# Altium schematic sheet 4_esp32.SchDoc
size A4; SheetNumber: 5; SheetTotal: 13
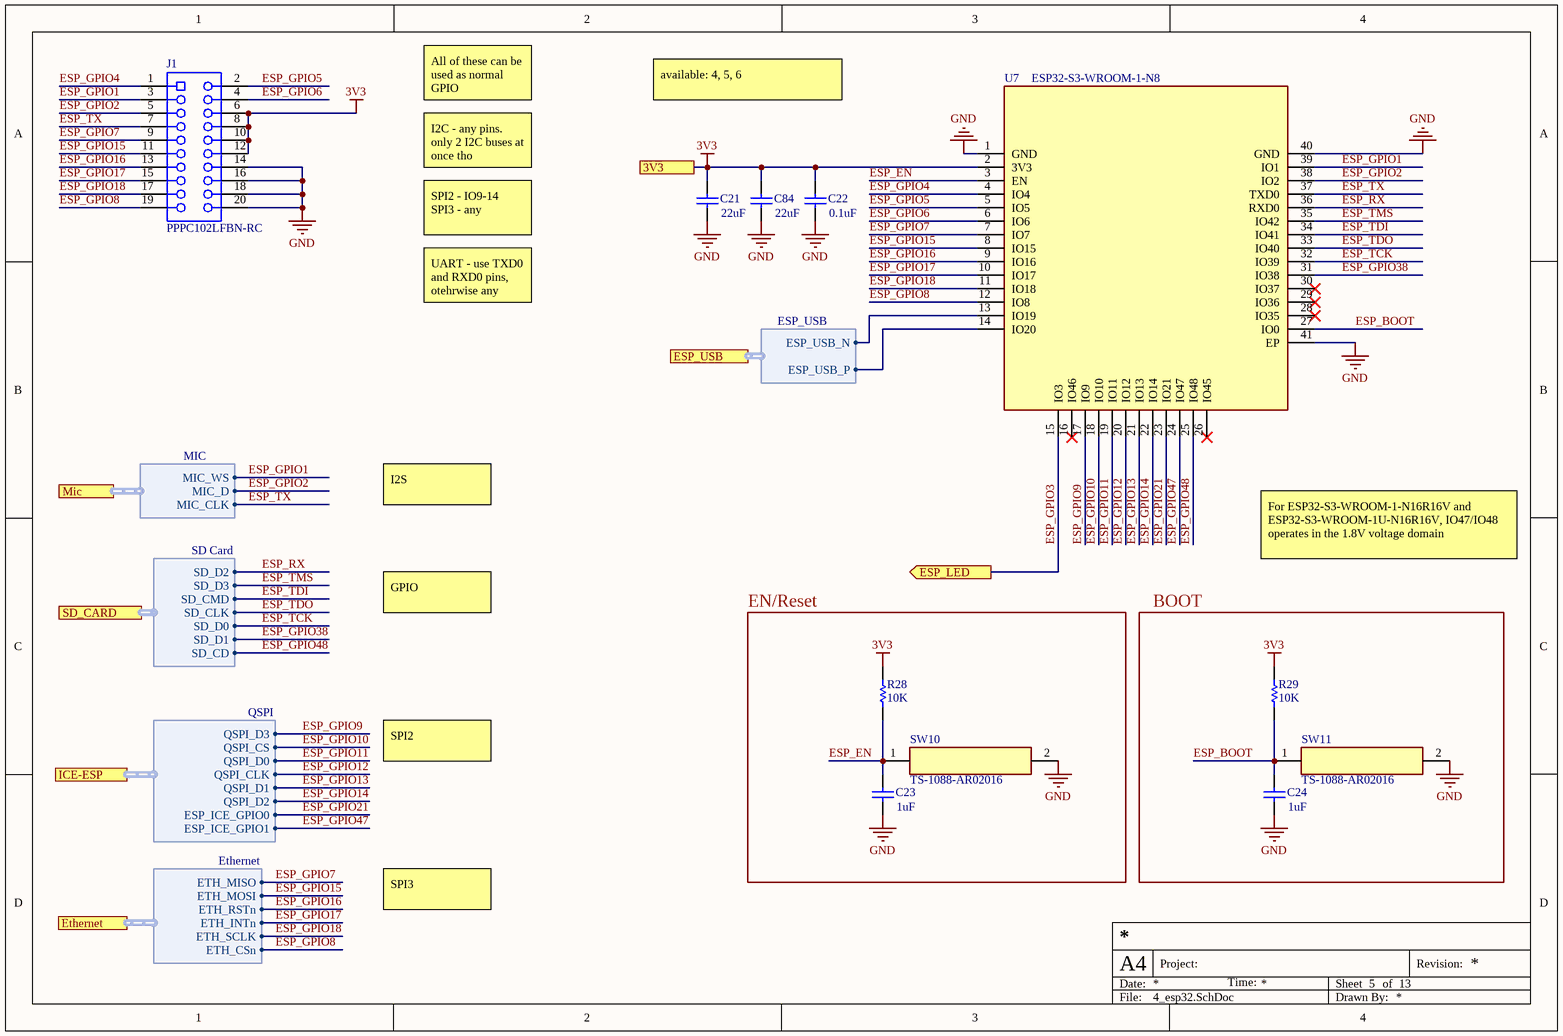
[diagram p0: 4_esp32.SchDoc]

## Parts
C21  22uF  [CAPC1609X100X15NL20]
C22  0.1uF  [CAPC1609X100X15NL20]
C23  1uF  [CAPC1609X100X15NL20]
C24  1uF  [CAPC1609X100X15NL20]
C84  22uF  [CAPC1609X100X15NL20]
J1  PPPC102LFBN-RC  [SLIN-PPPC102LFBN-RC_V]
R28  10K  [RESC1609X55X30NL10T20]
R29  10K  [RESC1609X55X30NL10T20]
SW10  TS-1088-AR02016  [SW-SMD_L3.9-W3.0-P4.45]
SW11  TS-1088-AR02016  [SW-SMD_L3.9-W3.0-P4.45]
U7  ESP32-S3-WROOM-1-N8  [WIFIM-SMD_ESP32-S3-WROOM-1-N8]

## Blocks framed on the sheet
EN/Reset: C23 R28 SW10
BOOT: C24 R29 SW11

## Ports
3V3, ESP_LED (out), ESP_USB (harness ESP_USB), Ethernet (harness Ethernet), ICE-ESP (harness QSPI), Mic (harness MIC), SD_CARD (harness SD Card)

## Harnesses
QSPI: QSPI_D3, QSPI_CS, QSPI_CLK, QSPI_D1, QSPI_D2, QSPI_D0, ESP_ICE_GPIO0, ESP_ICE_GPIO1
ESP_USB: ESP_USB_N, ESP_USB_P
Ethernet: ETH_MISO, ETH_MOSI, ETH_INTn, ETH_CSn, ETH_SCLK, ETH_RSTn
SD Card: SD_D2, SD_D3, SD_CMD, SD_CLK, SD_D0, SD_D1, SD_CD
MIC: MIC_WS, MIC_D, MIC_CLK

## Nets
3V3: C21.2 C22.2 C84.2 J1.6 J1.8 J1.10 J1.12 R28.2 R29.2 U7.2(3V3) ; port 3V3
GND: C21.1 C22.1 C23.1 C24.1 C84.1 J1.14 J1.16 J1.18 J1.20 SW10.2 SW11.2 U7.1(GND) U7.40(GND) U7.41(EP)
\: U7.32(IO39) ; port SD_CARD.SD_D0  [also labelled ESP_TCK]
ESP_BOOT: C24.2 R29.1 SW11.1 U7.27(IO0)
ESP_EN: C23.2 R28.1 SW10.1 U7.3(EN)
ESP_GPIO1: J1.3 U7.39(IO1) ; port Mic.MIC_WS
ESP_GPIO2: J1.5 U7.38(IO2) ; port Mic.MIC_D
ESP_GPIO3: U7.15(IO3) ; port ESP_LED
ESP_GPIO4: J1.1 U7.4(IO4)
ESP_GPIO5: J1.2 U7.5(IO5)
ESP_GPIO6: J1.4 U7.6(IO6)
ESP_GPIO7: J1.9 U7.7(IO7) ; port Ethernet.ETH_MISO
ESP_GPIO8: J1.19 U7.12(IO8) ; port Ethernet.ETH_CSn
ESP_GPIO9: U7.17(IO9) ; port ICE-ESP.QSPI_D3
ESP_GPIO10: U7.18(IO10) ; port ICE-ESP.QSPI_CS
ESP_GPIO11: U7.19(IO11) ; port ICE-ESP.QSPI_D0
ESP_GPIO12: U7.20(IO12) ; port ICE-ESP.QSPI_CLK
ESP_GPIO13: U7.21(IO13) ; port ICE-ESP.QSPI_D1
ESP_GPIO14: U7.22(IO14) ; port ICE-ESP.QSPI_D2
ESP_GPIO15: J1.11 U7.8(IO15) ; port Ethernet.ETH_MOSI
ESP_GPIO16: J1.13 U7.9(IO16) ; port Ethernet.ETH_RSTn
ESP_GPIO17: J1.15 U7.10(IO17) ; port Ethernet.ETH_INTn
ESP_GPIO18: J1.17 U7.11(IO18) ; port Ethernet.ETH_SCLK
ESP_GPIO21: U7.23(IO21) ; port ICE-ESP.ESP_ICE_GPIO0
ESP_GPIO38: U7.31(IO38) ; port SD_CARD.SD_D1
ESP_GPIO47: U7.24(IO47) ; port ICE-ESP.ESP_ICE_GPIO1
ESP_GPIO48: U7.25(IO48) ; port SD_CARD.SD_CD
ESP_RX: U7.36(RXD0) ; port SD_CARD.SD_D2
ESP_TDI: U7.34(IO41) ; port SD_CARD.SD_CMD
ESP_TDO: U7.33(IO40) ; port SD_CARD.SD_CLK
ESP_TMS: U7.35(IO42) ; port SD_CARD.SD_D3
ESP_TX: J1.7 U7.37(TXD0) ; port Mic.MIC_CLK
NetU7_13: U7.13(IO19) ; port ESP_USB.ESP_USB_N
NetU7_14: U7.14(IO20) ; port ESP_USB.ESP_USB_P

Not connected (* = marked no-connect by the designer): U7 16(IO46)* 26(IO45)* 28(IO35)* 29(IO36)* 30(IO37)*

## Notes on the sheet
- All of these can be used as normal GPIO
- available: 4, 5, 6
- I2C - any pins. only 2 I2C buses at once tho
- SPI2 - IO9-14
  SPI3 - any
- UART - use TXD0 and RXD0 pins, otehrwise any
- I2S
- For ESP32-S3-WROOM-1-N16R16V and ESP32-S3-WROOM-1U-N16R16V, IO47/IO48 operates in the 1.8V voltage domain
- GPIO
- SPI2
- SPI3
- Date:
- A4
- Project:
- Time:
- Sheet
- of
- Revision:
- File:
- Drawn By:

## Library data of the parts
C21-C24 C84 = CMP-2006-00183-1: Manufacturer: AVX Interconnect / Elco; Part Number: TACL105K006XTA
J1 = CMP-002-00029-2: Female Header, Pitch 2.54 mm, 2 x 10 Position, Height 8.75 mm, Tail Length 3.2 mm, -40 to 105 degC, RoHS, Bulk; Manufacturer: Sullins; Mounting Technology: TH; RoHS Compliant: Unknown; Gender: Female; Case/Package: PPPC102LFBN-RC; Min Operating Temperature: -40°C; Datasheet Version: Rev. D, 10/2007; Max Operating Temperature: 105°C; Package Description: Female Header, Pitch 2.54 mm, 2 x 10 Position, Height 8.75 mm, Tail Length 3.2 mm; Package Reference: PPPC102LFBN-RC; Connector Type: Header; Datasheet URL: http://datasheet.octopart.com/PPPC102LFBN-RC-Sullins-datasheet-8327184.pdf
R28 R29 = CMP-2000-03692-1: Manufacturer: Vishay Dale; Part Number: TNPW060310K0BEEN
SW10 SW11 = TS-1088-AR02016: Circuit:SPST Actuator Style:Round Button Operating Force:1.6N Mounting Type:Surface Mount,Vertical Length:3.9mm Width:3mm Switch Height:2mm with Bracket:Without Bracket Contact Current:50mA Voltage Rating:12V Actuator/Cap Color:Black With Lamp:- IP Rating; Manufacturer: XUNPU(讯普); Circuit: SPST; Operating Force: 1.6N; Switch Height: 2mm; Contact Current: 50mA; Voltage Rating: 12V; Actuator/Cap Color: Black; Life: 100,000 cycles; LCSC Part Name: 3.9*3*2mm 立贴 轻触开关; Supplier Part: C720477; Manufacturer Part: TS-1088-AR02016; Supplier Footprint: SMD,4x3mm; JLCPCB Part Class: Basic Part; Datasheet: https://item.szlcsc.com/datasheet/TS-1088-AR02016/763484.html; Supplier: LCSC; Actuator Style: Round Button; Mounting Type: Surface Mount,Vertical; Length: 3.9mm; Width: 3mm; with Bracket: Without Bracket; Termination Style: SMD(SMT) Tab; Operating Temperature: -30℃~+80℃
U7 = CMP-031-00007-1: Utilized IC / Part:ESP32-S3 Chip Wireless Standard:Bluetooth5.0 Interface Type:SPI；I2S；USB；I2C；UART Frequency:2.4GHz Antenna Type:On-board PCB Antenna Output Power:20.5dBm Output Power:20.5dBm Voltage - Supply:3V~3.6V Voltage - Supply:3V~3.6V Receive  Cur; Manufacturer: ESPRESSIF(乐鑫); Send  Current: 355mA; Receive  Current: 95mA; Sensitivity: -98.2dBm; Value: 2.4GHz; Supplier Footprint: SMD,25.5x18mm; LCSC Part Name: 不带固件 通用型Wi-Fi+低功耗蓝牙MCU模组; Interface Type: SPI；I2S；USB；I2C；UART; Antenna Type: On-board PCB Antenna; Design Item ID: ESP32-S3-WROOM-1-N8; Wireless Standard: Bluetooth5.0; Source: EasyEDA.schlib; Datasheet: https://item.szlcsc.com/datasheet/ESP32-S3-WROOM-1-N8/3198296.html; Manufacturer Part: ESP32-S3-WROOM-1-N8; Utilized IC / Part: ESP32-S3 Chip; Supplier Part: C2913198; Output Power: 20.5dBm; JLCPCB Part Class: Extended Part; Operating Temperature: -40℃~+85℃; Voltage - Supply: 3V~3.6V